# Altium schematic sheet Filters n Buffers.SchDoc
size A4; SheetNumber: 3; SheetTotal: 5
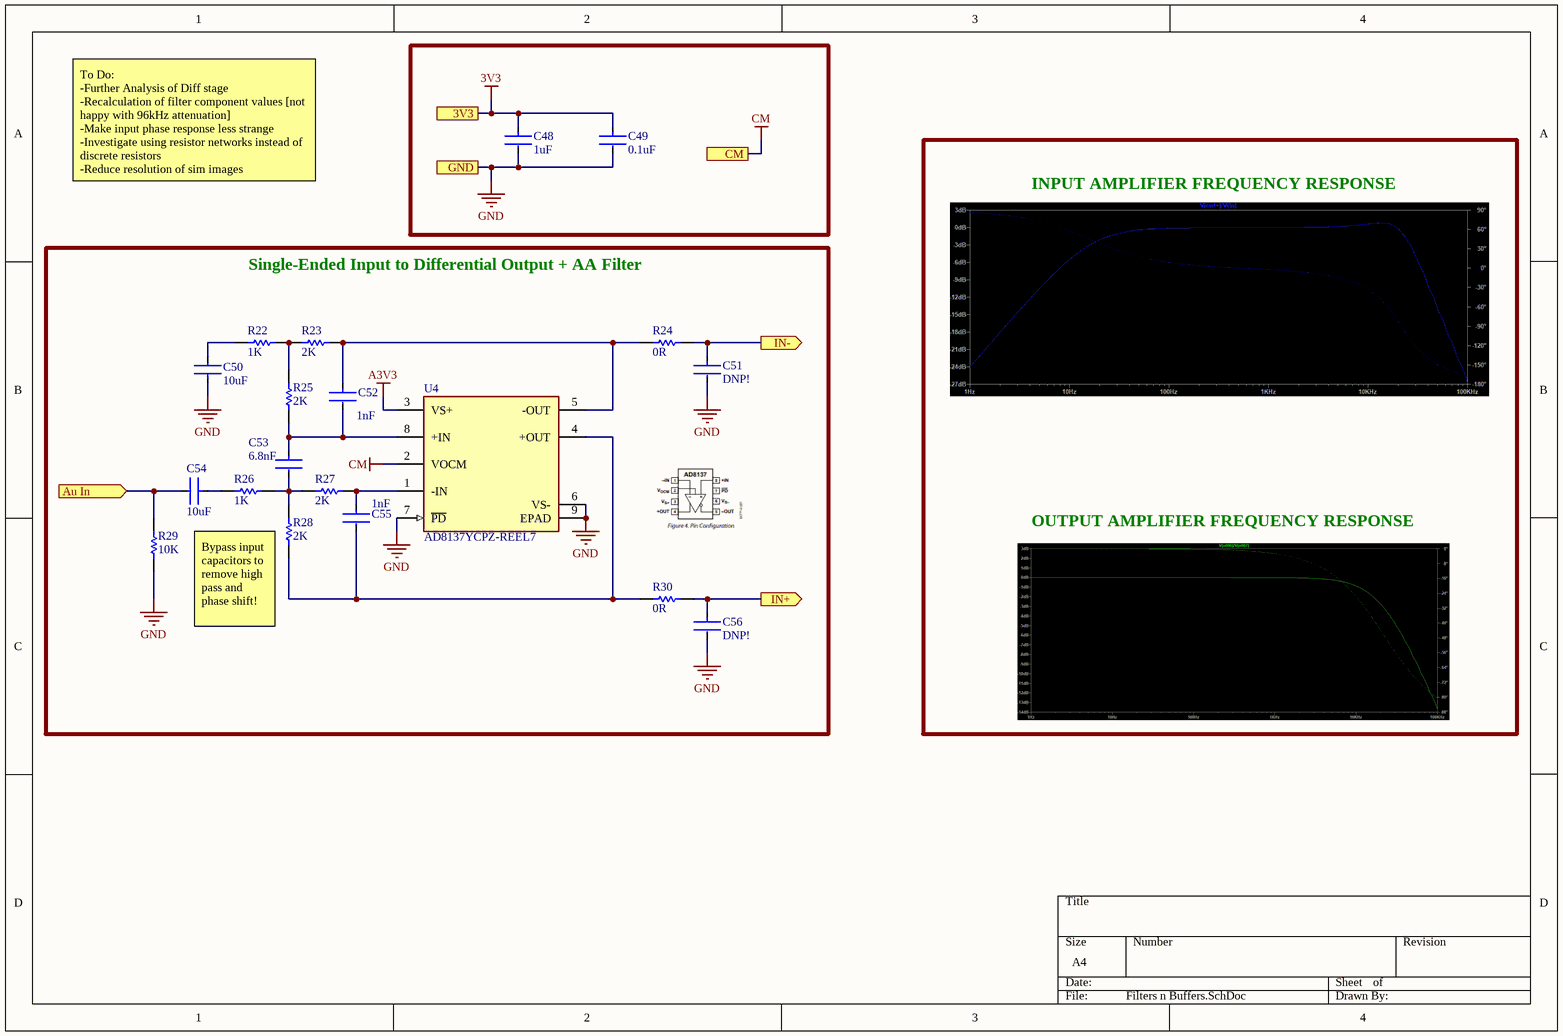
[diagram p0: Filters n Buffers.SchDoc]

## Parts
C48  1uF  [FP-GRM15-MFG]
C49  0.1uF  [FP-GRM15-MFG]
C50  10uF  [FP-GRM15-MFG]
C51  DNP!  [FP-GRM15-MFG]
C52  1nF  [FP-GRM15-MFG]
C53  6.8nF  [FP-GRM15-MFG]
C54  10uF  [FP-GRM15-MFG]
C55  1nF  [FP-GRM15-MFG]
C56  DNP!  [FP-GRM15-MFG]
R22  1K  [RESC1005X40X25LL05T05]
R23  2K  [RESC1005X40X25LL05T05]
R24  0R  [RESC1005X40X25LL05T05]
R25  2K  [RESC1005X40X25LL05T05]
R26  1K  [RESC1005X40X25LL05T05]
R27  2K  [RESC1005X40X25LL05T05]
R28  2K  [RESC1005X40X25LL05T05]
R29  10K  [RESC1005X40X25LL05T05]
R30  0R  [RESC1005X40X25LL05T05]
U4  AD8137YCPZ-REEL7  [FP-CP-8-13-IPC_C]

## Blocks framed on the sheet
Single-Ended Input to Differential Output + AA Filter: C50-C56 R22-R30 U4

## Ports
3V3, Au In (in), CM, GND, IN+ (out), IN- (out)

## Nets
3V3: C48.2 C49.2 ; port 3V3
A3V3: U4.3(VS+)
CM: U4.2(VOCM) ; port CM
GND: C48.1 C49.1 C50.2 C51.1 C56.1 R29.2 U4.6(VS-) U4.7(~{PD}) U4.9(EPAD) ; port GND
Au In: C54.1 R29.1 ; port Au In
IN+: C56.2 R30.2 ; port IN+
IN-: C51.2 R24.2 ; port IN-
NetC50_1: C50.1 R22.1
NetC52_1: C52.1 C53.2 R25.1 U4.8(+IN)
NetC52_2: C52.2 R23.2 R24.1 U4.5(-OUT)
NetC53_1: C53.1 R26.2 R27.1 R28.2
NetC54_2: C54.2 R26.1
NetC55_1: C55.1 R28.1 R30.1 U4.4(+OUT)
NetC55_2: C55.2 R27.2 U4.1(-IN)
NetR22_2: R22.2 R23.1 R25.2

## Notes on the sheet
- To Do:
  -Further Analysis of Diff stage
  -Recalculation of filter component values [not happy with 96kHz attenuation]
  -Make input phase response less strange
  -Investigate using resistor networks instead of discrete resistors
  -Reduce resolution of sim images
- INPUT AMPLIFIER FREQUENCY RESPONSE
- OUTPUT AMPLIFIER FREQUENCY RESPONSE
- (near R28) Bypass input capacitors to remove high pass and phase shift!

## Library data of the parts
C48-C56 = CMP-2100-03641-2: CAP CER 0.1UF 16V X7R 0402; Manufacturer Part Number: GRM155R71C104KA88D; Manufacturer: Murata; Standoff Height: 0mm; Tolerance: 10%; Voltage Rating: 16Vdc; Material: Ceramic; Capacitance: 0.10μF; Value: 0.10μF; RoHS: TRUE; Temperature Characteristic: X7R; Octopart: https://octopart.com/grm155r71c104ka88d-murata-196880; Digikey Description: CAP CER 0.1UF 16V X7R 0402; Device Class L3: Ceramic Capacitors; Height: 0.55mm; ComponentLink2Description: Datasheet; Temperature Range Low: -55°C; Ipc Land Pattern Name: CAPC10050X219; ComponentLink2URL: https://search.murata.co.jp/Ceramy/image/img/A01X/G101/ENG/GRM155R71H471KA01-01A.pdf; Device Class L1: Passive Components; Lead Free: yes; Category: Cap; Package: GRM15; Temperature: -55°C to +125°C; Device Class L2: Capacitors; Temperature Range High: +125°C; Mouser Description: 0402 0.1 uF 16V ±10 % Tolerance X7R SMT Multilayer Ceramic Capacitor
R22-R30 = CMP-2000-07451-1: Chip Resistor, 0 Ohm, 0.1 W, -55 to 155 degC, 0402 (1005 Metric), RoHS, Tape and Reel; Manufacturer: Panasonic; Voltage Rating (DC): 50V; Temperature Coefficient: 600ppm/��C; Max Power Dissipation: 100mW; Resistance: 0mOhm; Tolerance: 5%; Number of Terminations: 2; Mount: SurfaceMount; Height: 0.35mm; Packaging: TapeandReel; Contact Plating: Tin; Manufacturer URL: http://www.panasonic.com/; Composition: ThickFilm; Max Operating Temperature: 155degC; REACH SVHC: NoSVHC; Case/Package: 0402; Package Reference: 402; Depth: 0.5mm; Package Description: 2-Pin Surface Mount Device, Body 1 x 0.5 mm; Datasheet URL: https://industrial.panasonic.com/cdbs/www-data/pdf/RDA0000/AOA0000C301.pdf; RoHSCompliant: True; Case Code (Imperial): 0402; Military Standard: Not; Min Operating Temperature: -55degC; Power Rating: 100mW; Datasheet Version: 03/2015; Length: 1mm; Case Code (Metric): 1005; Termination: SMD/SMT; Mounting Technology: SurfaceMount; Voltage Rating: 50V; Width: 0.02inch; Package Quantity: 1; Lead Free: LeadFree; Radiation Hardening: No
U4 = CMP-09116-000220-1: IC OPAMP DIFF 1 CIRCUIT 8LFCSP; Power Supply Rejection Ratio (PSRR): 79dB; Gain Bandwidth Product: 110MHz; Supply Current: 3.2mA; Number of Amplifiers: 1; Input Offset Voltage (Vos): 2.7mV; Input Resistance: 800kR; Operating Supply Current: 3.6mA; Amplifier Type: DIFFERENTIAL; Min Dual Supply Voltage: 1.35V; Max Supply Voltage: 12V; Common Mode Rejection Ratio: 66dB; Output Current per Channel: 20mA; Max Dual Supply Voltage: 6V; Settling Time: 100ns; Max Supply Current: 245uA; Voltage Gain: 89dB; Slew Rate: 450V/µs; Min Supply Voltage: 2.7V; Input Bias Current: 900nA; Number of Bits: 12; Package Quantity: 1; Max Operating Temperature: 125°C; Number of Pins: 8; RoHS Compliant: Yes; Width: 3.1mm; Nominal Supply Current: 3.2mA; Bandwidth: 110MHz; Lead Free: Contains Lead; Height: 0.8mm; Number of Circuits: 1; Number of Channels: 1; Length: 3.1mm; Series: -; Min Operating Temperature: -40°C; Radiation Hardening: No; -3db Bandwidth: 110MHz; Number of Elements: 1; Packaging: Tape and Reel; Mount: Surface Mount; Case/Package: LFCSP EP; REACH SVHC: No SVHC